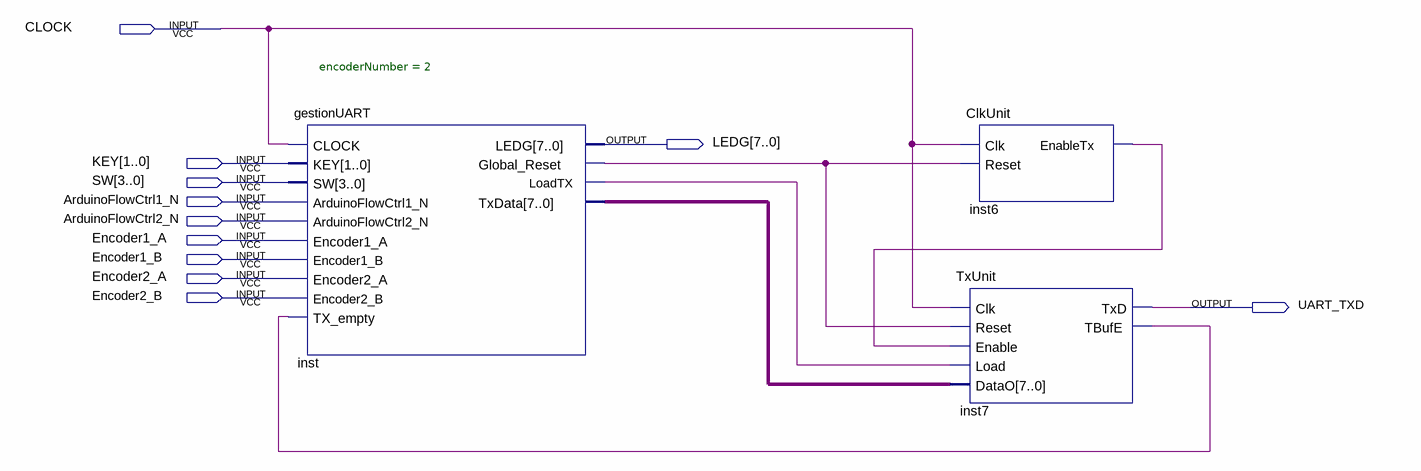
[diagram p0: schematic sheet]
// Quartus schematic version2.bdf as structural Verilog: 3 symbols, 11 pins
module version2 (
  input  CLOCK,
  input  [1:0] KEY,
  input  [3:0] SW,
  input  ArduinoFlowCtrl1_N,
  input  ArduinoFlowCtrl2_N,
  input  Encoder1_A,
  input  Encoder1_B,
  input  Encoder2_A,
  input  Encoder2_B,
  output [7:0] LEDG,
  output UART_TXD
);

  wire inst6_enabletx, inst7_tbufe, inst_global_reset, inst_loadtx;
  wire [7:0] inst_txdata;

  gestionUART #(.encoderNumber(2)) inst (
    .CLOCK(CLOCK), .KEY(KEY), .SW(SW), .ArduinoFlowCtrl1_N(ArduinoFlowCtrl1_N),
    .ArduinoFlowCtrl2_N(ArduinoFlowCtrl2_N), .Encoder1_A(Encoder1_A), .Encoder1_B(Encoder1_B),
    .Encoder2_A(Encoder2_A), .Encoder2_B(Encoder2_B), .TX_empty(inst7_tbufe), .LEDG(LEDG),
    .Global_Reset(inst_global_reset), .LoadTX(inst_loadtx), .TxData(inst_txdata));
  ClkUnit inst6 (.Clk(CLOCK), .Reset(inst_global_reset), .EnableTx(inst6_enabletx));
  TxUnit inst7 (
    .Clk(CLOCK), .Reset(inst_global_reset), .Enable(inst6_enabletx), .Load(inst_loadtx), .DataO(inst_txdata),
    .TxD(UART_TXD), .TBufE(inst7_tbufe));
endmodule
